# EAGLE design esp32_lolin_clone (EAGLE 9.6.2)
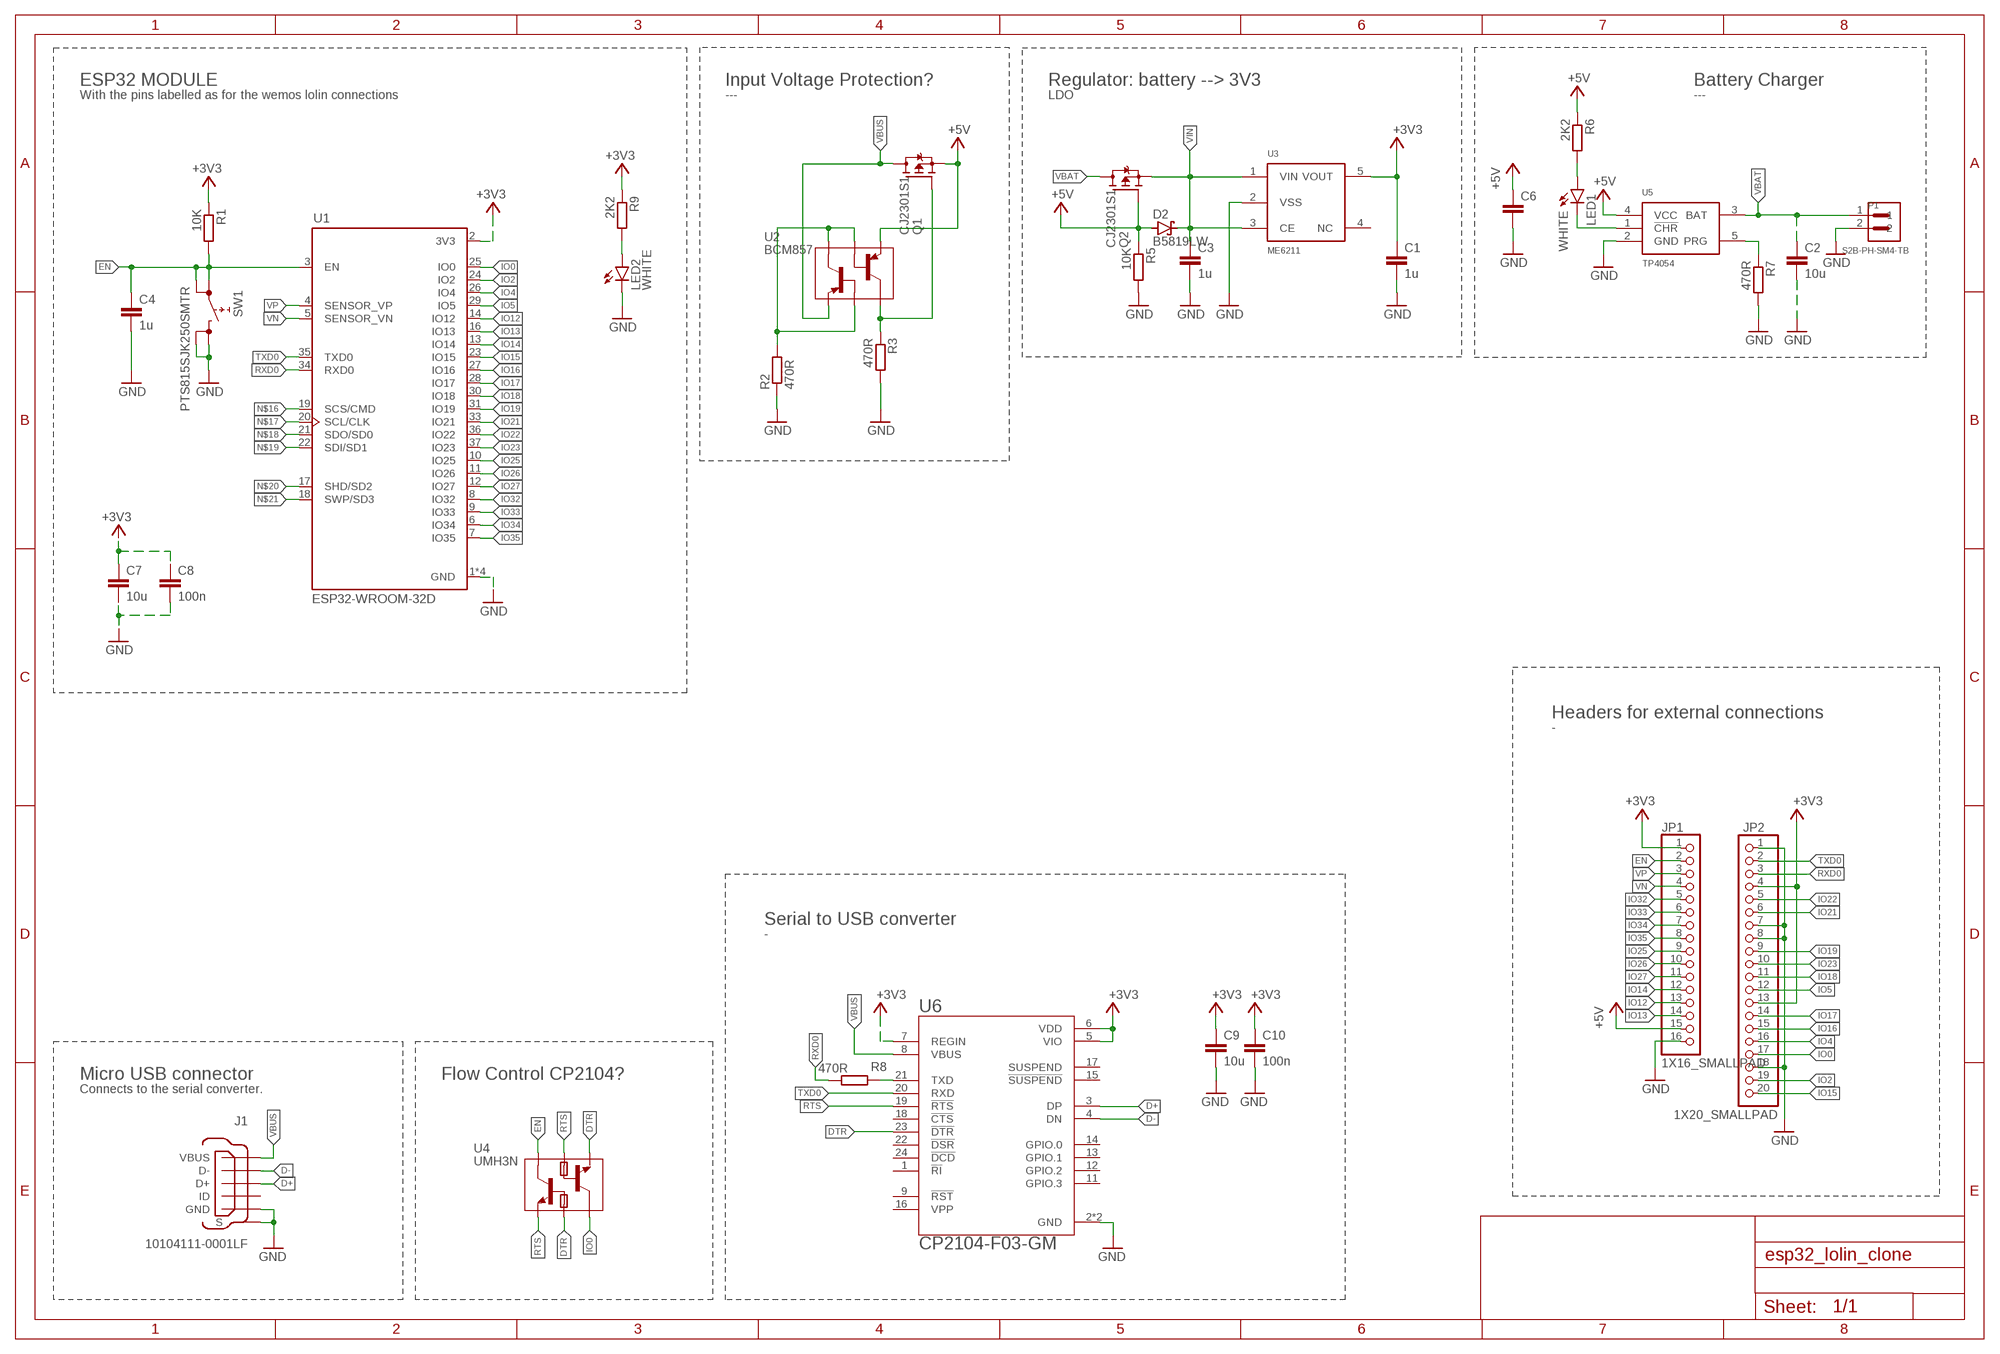
[diagram p0: schematic, sheet 1]

## Parts
C1  1u  C-EUC0603K  [C0603K]
C2  10u  C-EUC0603K  [C0603K]
C3  1u  C-EUC0603K  [C0603K]
C4  1u  C-EUC0603K  [C0603K]
C6  C-EUC0603K  [C0603K]
C7  10u  C-EUC0603K  [C0603K]
C8  100n  C-EUC0603K  [C0603K]
C9  10u  C-EUC0603K  [C0603K]
C10  100n  C-EUC0603K  [C0603K]
D2  B5819LW  [SOD123]
J1  10104111-0001LF  [FRAMATOME_10104111-0001LF]
JP1  1X16_SMALLPAD  [1X16]
JP2  1X20_SMALLPAD  [1X20]
LED1  WHITE  LEDCHIP-LED0603  [CHIP-LED0603]
LED2  WHITE  LEDCHIP-LED0603  [CHIP-LED0603]
P1  S2B-PH-SM4-TB  [JST_S2B-PH-SM4-TB]
Q1  CJ2301S1  [SOT23]
Q2  CJ2301S1  [SOT23]
R1  10K  R-EU_R0603  [R0603]
R2  470R  R-EU_R0603  [R0603]
R3  470R  R-EU_R0603  [R0603]
R5  10K  R-EU_R0603  [R0603]
R6  2K2  R-EU_R0603  [R0603]
R7  470R  R-EU_R0603  [R0603]
R8  470R  R-EU_R0603  [R0603]
R9  2K2  R-EU_R0603  [R0603]
SW1  PTS815SJK250SMTR  [PTS815SJK250SMTR]
U1  ESP32-WROOM-32D  [MODULE_ESP32-WROOM-32D]
U2  BCM857  [SOT363_INFINEON]
U3  ME6211  [SOT23-5]
U4  UMH3N  [SOT363_INFINEON]
U5  TP4054  [SOT23-5]
U6  CP2104-F03-GM  [QFN50P400X400X80-25N]

## Nets
+3V3 [3V3]: C1.1 C7.1 C8.1 C9.1 C10.1 JP1.1 JP2.4 JP2.13 R1.1 R9.1 U1.2(3V3) U3.5(VOUT) U6.5(VIO) U6.6(VDD) U6.7(REGIN)
+5V [5V]: C6.1 D2.2(A) JP1.15 Q1.2(S) Q2.1(G) R5.1 R6.1 U2.4(E2) U5.4(VCC)
D+: J1.3(D+) U6.3(DP)
D-: J1.2(D-) U6.4(DN)
DTR: U4.2(B1) U4.4(E2) U6.23(!DTR)
EN: C4.1 JP1.2 R1.2 SW1.1 SW1.2 U1.3(EN) U4.6(C1)
GND: C1.2 C2.2 C3.2 C4.2 C6.2 C7.2 C8.2 C9.2 C10.2 J1.5(GND) J1.6(S) J1.7(S) J1.8(S) J1.9(S) JP1.16 JP2.1 JP2.7 JP2.8 JP2.18 LED2.C P1.2 R2.1 R3.2 R5.2 R7.2 SW1.3 SW1.4 U1.1(GND) U1.15(GND) U1.38(GND) U1.39(GND) U3.2(VSS) U5.2(GND) U6.2(GND) U6.25(GND)
IO0: JP2.17 U1.25(IO0) U4.3(C2)
IO2: JP2.19 U1.24(IO2)
IO4: JP2.16 U1.26(IO4)
IO5: JP2.12 U1.29(IO5)
IO12: JP1.13 U1.14(IO12)
IO13: JP1.14 U1.16(IO13)
IO14: JP1.12 U1.13(IO14)
IO15: JP2.20 U1.23(IO15)
IO16: JP2.15 U1.27(IO16)
IO17: JP2.14 U1.28(IO17)
IO18: JP2.11 U1.30(IO18)
IO19: JP2.9 U1.31(IO19)
IO21: JP2.6 U1.33(IO21)
IO22: JP2.5 U1.36(IO22)
IO23: JP2.10 U1.37(IO23)
IO25: JP1.9 U1.10(IO25)
IO26: JP1.10 U1.11(IO26)
IO27: JP1.11 U1.12(IO27)
IO32: JP1.5 U1.8(IO32)
IO33: JP1.6 U1.9(IO33)
IO34: JP1.7 U1.6(IO34)
IO35: JP1.8 U1.7(IO35)
N$1: R8.1 U6.21(TXD)
N$2: LED2.A R9.2
N$3: LED1.C U5.1(!CHR)
N$4: LED1.A R6.2
N$7: R2.2 U2.2(B1) U2.5(B2) U2.6(C1)
N$9: Q1.1(G) R3.1 U2.3(C2)
N$14: R7.1 U5.5(PRG)
N$16: U1.19(SCS/CMD)
N$17: U1.20(SCL/CLK)
N$18: U1.21(SDO/SD0)
N$19: U1.22(SDI/SD1)
N$20: U1.17(SHD/SD2)
N$21: U1.18(SWP/SD3)
RTS: U4.1(E1) U4.5(B2) U6.19(!RTS)
RXD0: JP2.3 R8.2 U1.34(RXD0)
TXD0: JP2.2 U1.35(TXD0) U6.20(RXD)
VBAT [VBAT]: C2.1 P1.1 Q2.3(D) U5.3(BAT)
VBUS [5V]: J1.1(VBUS) Q1.3(D) U2.1(E1) U6.8(VBUS)
VIN [5V]: C3.1 D2.1(C) Q2.2(S) U3.1(VIN) U3.3(CE)
VN: JP1.4 U1.5(SENSOR_VN)
VP: JP1.3 U1.4(SENSOR_VP)
Unconnected: J1.4(ID) U3.4(NC) U6.1(!RI) U6.9(!RST!) U6.11(GPIO.3) U6.12(GPIO.2) U6.13(GPIO.1) U6.14(GPIO.0) U6.15(!SUSPEND!) U6.16(VPP) U6.17(SUSPEND) U6.18(!CTS) U6.22(!DSR) U6.24(!DCD)

## Notes on the sheet
- ESP32 MODULE | Input Voltage Protection? | Regulator: battery --> 3V3 | Battery Charger
- With the pins labelled as for the wemos lolin connections | --- | LDO | ---
- Headers for external connections
- -
- Serial to USB converter
- -
- Micro USB connector | Flow Control CP2104?
- Connects to the serial converter.

## Library data of the parts
C1-C4 C6-C10 = rcl:C-EU: CAPACITOR, European symbol; SPICEPREFIX: C
D2 = RE_wemos_lolin_clone:B5819LW: B5819W: SCHOTTKY BARRIER DIODE Peak reverse voltage = 40V RMS Reverse Voltage = 28V Average max current = 0.5A Peak max current = 1.5A Please refer to the Datasheet <https://datasheet.lcsc.com/szlcsc/1810190911_Guangdong-Hottech-B5819LW_C181206.pdf> for more information.; DISTRIBUTOR: LCSC; DISTRIBUTOR_REF: C181206; MANUFACTURER: Guangdong Hottech; MANUFACTURER_REF: B5819LW
J1 = RE_wemos_lolin_clone:10104111-0001LF: 10104111-0001LF:Conn USB Type A/B RCP 5 POS 0.65mm Solder RA SMD 5 Terminal 1 Port T/R. Please refer to the Datasheet <https://www.mouser.de/datasheet/2/18/10104111-1361291.pdf> for more information.; DISTRIBUTOR: Mouser; DISTRIBUTOR_REF: 649-10104111-0001LF; MANUFACTURER: Amphenol ICC; MANUFACTURER_REF: 10104111-0001LF
JP1 = RE_wemos_lolin_clone:1X16_SMALLPAD
JP2 = RE_wemos_lolin_clone:1X20_SMALLPAD
LED1 LED2 = led:LED: LED OSRAM: - CHIPLED LG R971, LG N971, LY N971, LG Q971, LY Q971, LO R971, LY R971 LH N974, LH R974 LS Q976, LO Q976, LY Q976 LO Q996 - Hyper CHIPLED LW Q18S LB Q993, LB Q99A, LB R99A - SideLED LS A670, LO A670, LY A670, LG A670, LP A670 LB A673, LV A673, LT A673, LW A673 LH A674 LY A675 LS A676, LA A676, LO A676, LY A676, LW A676 LS A679, LY A679, LG A679 - Hyper Micro SIDELED® LS Y876, LA Y876, LO Y876, LY Y876 LT Y87S - SmartLED LW L88C, LW L88S LB L89C, LB L89S, LG L890 LS L89K, LO L89K, LY L89K LS L896, LA L896, LO L896, LY L896 - TOPLED LS T670, LO T670, LY T670, LG T670, LP T670 LSG T670, LSP T670, LSY T670, LOP T670, LYG T670 LG T671, LOG T671, LSG T671 LB T673, LV T673, LT T673, LW T673 LH T674 LS T676, LA T676, LO T676, LY T676, LB T676, LH T676, LSB T676, LW T676 LB T67C, LV T67C, LT T67C, LS T67K, LO T67K, LY T67K, LW E67C LS E67B, LA E67B, LO E67B, LY E67B, LB E67C, LV E67C, LT E67C LW T67C LS T679, LY T679, LG T679 LS T770, LO T770, LY T770, LG T770, LP T770 LB T773, LV T773, LT T773, LW T773 LH T774 LS E675, LA E675, LY E675, LS T675 LS T776, LA T776, LO T776, LY T776, LB T776 LHGB T686 LT T68C, LB T68C - Hyper Mini TOPLED® LB M676 - Mini TOPLED Santana® LG M470 LS M47K, LO M47K, LY M47K Source: http://www.osram.convergy.de LUXEON: - LUMILED® LXK2-PW12-R00, LXK2-PW12-S00, LXK2-PW14-U00, LXK2-PW14-V00 LXK2-PM12-R00, LXK2-PM12-S00, LXK2-PM14-U00 LXK2-PE12-Q00, LXK2-PE12-R00, LXK2-PE12-S00, LXK2-PE14-T00, LXK2-PE14-U00 LXK2-PB12-K00, LXK2-PB12-L00, LXK2-PB12-M00, LXK2-PB14-N00, LXK2-PB14-P00, LXK2-PB14-Q00 LXK2-PR12-L00, LXK2-PR12-M00, LXK2-PR14-Q00, LXK2-PR14-R00 LXK2-PD12-Q00, LXK2-PD12-R00, LXK2-PD12-S00 LXK2-PH12-R00, LXK2-PH12-S00 LXK2-PL12-P00, LXK2-PL12-Q00, LXK2-PL12-R00 Source: www.luxeon.com KINGBRIGHT: KA-3528ASYC Source: www.kingbright.com
P1 = RE_wemos_lolin_clone:S2B-PH-SM4-TB: CONN HEADER PH SIDE 2POS 2MM SMD; DISTRIBUTOR: Farnell; DISTRIBUTOR_REF: 9492615; MANUFACTURER: JST Sales; MANUFACTURER_REF: S2B-PH-SM4-TB
Q1 Q2 = RE_wemos_lolin_clone:CJ2301S1: CJ2301S1: P-Channel 20-V(D-S) MOSFET VdsMax = -20V VgsMax = +-8V IDmax = -2.3A IdPulseMax = -10A Please refer to the Datasheet <https://datasheet.lcsc.com/szlcsc/1809141711_Changjiang-Electronics-Tech-CJ-CJ2301-S1_C8547.pdf> for more information.; DISTRIBUTOR: LCSC; DISTRIBUTOR_REF: C8547; MANUFACTURER: Changjiang Electronics Tech; MANUFACTURER_REF: CJ2301 S1
R1-R3 R5-R9 = rcl:R-EU_: RESISTOR, European symbol; SPICEPREFIX: R
SW1 = RE_wemos_lolin_clone:PTS815SJK250SMTR: Datasheet: https://www.mouser.de/datasheet/2/60/pts815-1535658.pdf; DISTRIBUTOR: Mouser; DISTRIBUTOR_REF: 611-PTS815SJK250SMTR; MANUFACTURER: C&K; MANUFACTURER_REF: PTS815SJK250SMTRLFS
U1 = ML_badge:ESP32-WROOM-32D: IC: SoC; GPIO, I2C, I2S, IR, SD, SDIO, SPI, UART; 2.7÷3.6VDC; 20dBm; DISTRIBUTOR: Mouser; DISTRIBUTOR_REF: 356-ESP32WROOM-32D; MANUFACTURER: Espressif Systems; MANUFACTURER_REF: ESP32-WROOM-32D
U2 = RE_wemos_lolin_clone:BCM857: Maximum Output Current: 500mA （VIN＝4.3V,VOUT＝3.3V） Dropout Voltage:100mV@ IOUT=100mA Operating Voltage Range:2V～6.0V Highly Accuracy:±2％ Please refer to the Datasheet <https://assets.nexperia.com/documents/data-sheet/BCM857BV_BS_DS.pdf> for more information.; DISTRIBUTOR: Mouser; DISTRIBUTOR_REF: 771-BCM857BS135; MANUFACTURER: Nexperia; MANUFACTURER_REF: BCM857BS,135
U3 = RE_wemos_lolin_clone:ME6211: ME6211: High Speed LDO Regulators, High PSRR, Low noise, ME6211 Series Maximum Output Current: 500mA （VIN＝4.3V,VOUT＝3.3V） Dropout Voltage:100mV@ IOUT=100mA Operating Voltage Range:2V～6.0V Highly Accuracy:±2％ Please refer to the Datasheet <https://datasheet.lcsc.com/szlcsc/Nanjing-Micro-One-Elec-ME6211C33M5G-N_C82942.pdf> for more information.; DISTRIBUTOR: LCSC; DISTRIBUTOR_REF: C82942; MANUFACTURER: MICRONE; MANUFACTURER_REF: ME6211C33M5G-N
U4 = RE_wemos_lolin_clone:UMH3N: UMH3N: NPN 100mA 50V Complex Digital Transistors (Bias Resistor Built-in Transistors) VCEO = 50V IC(Max.) = 100mA R1 = 4.7kW Built-In Biasing Resistors Please refer to the Datasheet <https://www.mouser.com/datasheet/2/348/umh3ntn-e-1018108.pdf> for more information.; DISTRIBUTOR: Mouser; DISTRIBUTOR_REF: 755-UMH3NFHATN; MANUFACTURER: Rohm; MANUFACTURER_REF: UMH3NFHATN
U5 = RE_wemos_lolin_clone:TP4054: TP4054: Standalone Linear Li-lon Battery Charger with Thermal Regulation in SOT Programmable Charge Current Up to 800mA No MOSFET, Sense Resistor or Blocking Diode Required Preset 4.2V Charge Voltage with 1% Accuracy Charge Status Output Pin Please refer to the CHINESE Datasheet <https://datasheet.lcsc.com/szlcsc/1809261814_TOPPOWER-Nanjing-Extension-Microelectronics-TP4054_C32574.pdf> for more information. Please refer to the TRANSLATED Datasheet <https://www.google.com/url?sa=t&rct=j&q=&esrc=s&source=web&cd=3&cad=rja&uact=8&ved=2ahUKEwi-yqyskMTmAhWHzoUKHW4gB68QFjACegQIAhAC&url=http%3A%2F%2Fimages.100y.com.tw%2Fpdf_file%2F38-TP-TP4054x.pdf&usg=AOvVaw0sjPkwyLlJS0qSuuHZbuhl> for more information.; DISTRIBUTOR: LCSC; DISTRIBUTOR_REF: C32574; MANUFACTURER: TOPPOWER; MANUFACTURER_REF: TP4054
U6 = RE_wemos_lolin_clone:CP2104: Silabs CP2104 USB to UART Bridge USB Bridge, USB to UART USB 2.0 UART Interface 24-QFN _4x4_; DISTRIBUTOR: Mouser; DISTRIBUTOR_REF: None; MANUFACTURER: Silabs; MANUFACTURER_REF: CP2104

## Net classes
0 default: width 0.152 mm, drill 0.3 mm
1 GND: width 0.2 mm, drill 0.3 mm
2 3V3: width 0.5 mm
3 5V: width 0.5 mm
4 VBAT: width 0.6 mm

## Board
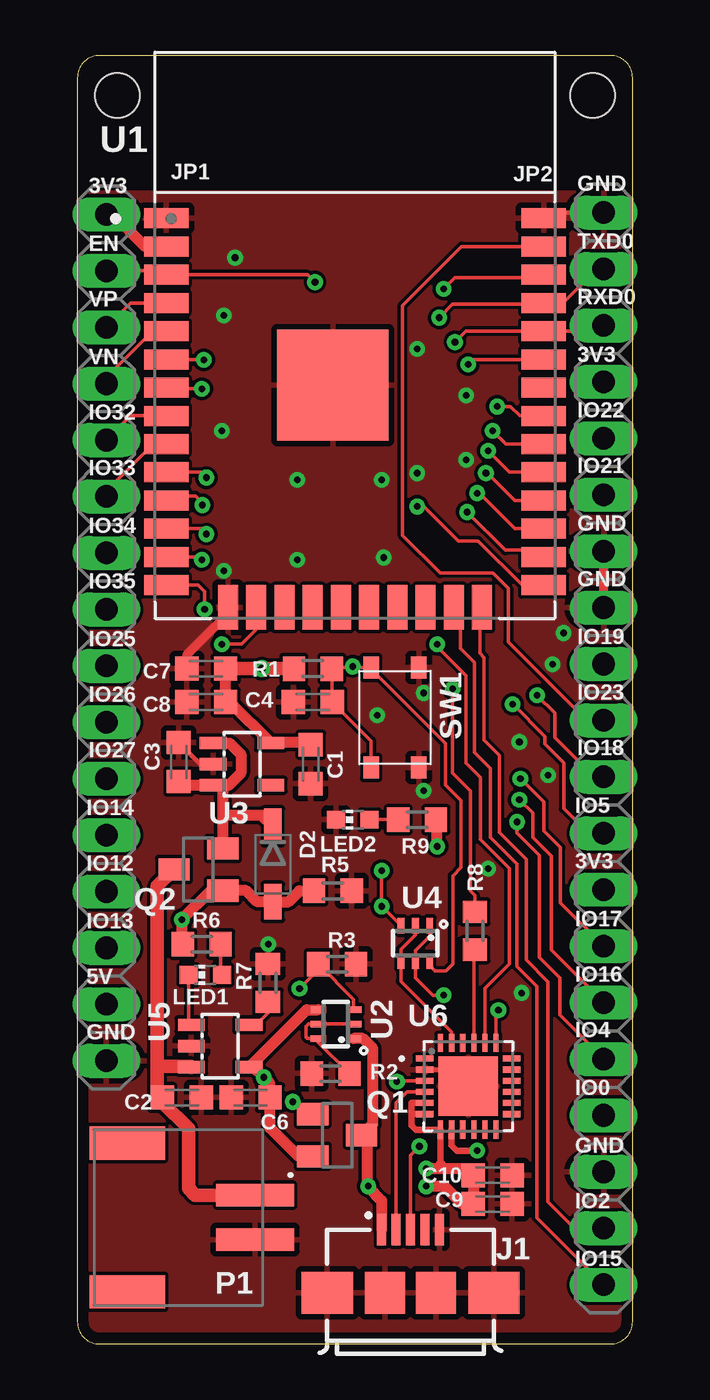
[diagram p1: board, top side]
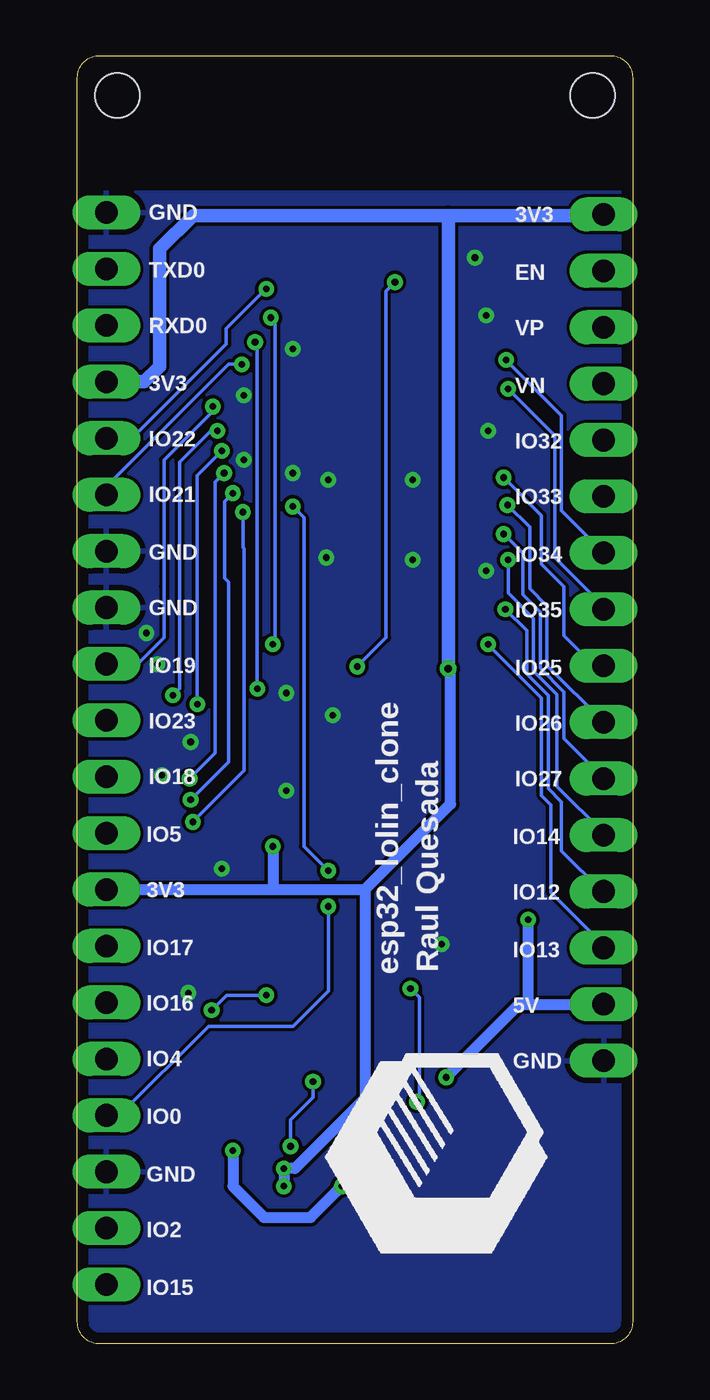
[diagram p2: board, bottom side, seen from below]

Size 25 x 58 mm. Coordinates in mm from the lower left corner, seen from the top.
Outline: 24,58 1,58 arc90 0,57 0,1 arc90 1,0 24,0 arc90 25,1 25,57 arc90 24,58
Copper layers (1*16): Top 0.035mm / dielectric 1.5mm / Bottom 0.035mm
Design rules "ND_PCBWay_2layers_basic": minimum track width 6mil, minimum drill 0.3mm, track to track 6mil, track to pad 6mil, pad to pad 6mil, via to via 6mil, smd to smd 6mil, copper to edge 20mil, drill to drill 6mil, minimum pad ring 10mil, minimum via ring 8mil, stop-mask expansion 4mil, vias tented up to drill 0.5mm, thermal gap 10mil
Holes 2 mm at 1.8,56.2 23.2,56.2
tRestrict: area -1,52 to 26,60
bRestrict: area -2,52 to 27,61

### Footprints (pad centres in the part's own frame; a part is rotated, then mirrored left to right if it is on the bottom)
C0603K = smd 1.05 x 1.08: 1 -0.875,0; 2 0.875,0
SOD123 = smd 1.6 x 0.8: 1 -1.7,0; 2 1.7,0
FRAMATOME_10104111-0001LF = smd 0.4 x 1.4: 1 -1.3,2.85; 2 -0.65,2.85; 3 0,2.85; 4 0.65,2.85; 5 1.3,2.85 | smd 2.3 x 1.9: 6 -3.75,0; 9 3.75,0 | smd 1.8 x 1.9: 7 -1.15,0; 8 1.15,0
1X16 = drill 1.016 pad 1.2 long: 1 -19.05,0; 2 -16.51,0; 3 -13.97,0; 4 -11.43,0; 5 -8.89,0; 6 -6.35,0; 7 -3.81,0; 8 -1.27,0; 9 1.27,0; 10 3.81,0; 11 6.35,0; 12 8.89,0; 13 11.43,0; 14 13.97,0; 15 16.51,0; 16 19.05,0
1X20 = drill 1.016 pad 1.2 long: 1 -24.13,0; 2 -21.59,0; 3 -19.05,0; 4 -16.51,0; 5 -13.97,0; 6 -11.43,0; 7 -8.89,0; 8 -6.35,0; 9 -3.81,0; 10 -1.27,0; 11 1.27,0; 12 3.81,0; 13 6.35,0; 14 8.89,0; 15 11.43,0; 16 13.97,0; 17 16.51,0; 18 19.05,0; 19 21.59,0; 20 24.13,0
CHIP-LED0603 = smd 0.8 x 0.8: A 0,-0.75; C 0,0.75
JST_S2B-PH-SM4-TB = smd 1 x 3.5: 1 1,0; 2 -1,0 | smd 1.5 x 3.4: P1 3.35,5.75; P2 -3.35,5.75
SOT23 = smd 1 x 1.4: 1 -0.95,-1.1; 2 0.95,-1.1; 3 0,1.1
R0603 = smd 1 x 1.1: 1 -0.85,0; 2 0.85,0
PTS815SJK250SMTR = smd 1 x 0.7: 1 -2.25,1.075; 2 2.25,1.075; 3 -2.25,-1.075; 4 2.25,-1.075
MODULE_ESP32-WROOM-32D = smd 2 x 0.9: 1 -8.5,5.26; 2 -8.5,3.99; 3 -8.5,2.72; 4 -8.5,1.45; 5 -8.5,0.18; 6 -8.5,-1.09; 7 -8.5,-2.36; 8 -8.5,-3.63; 9 -8.5,-4.9; 10 -8.5,-6.17; 11 -8.5,-7.44; 12 -8.5,-8.71; 13 -8.5,-9.98; 14 -8.5,-11.25; 25 8.5,-11.25; 26 8.5,-9.98; 27 8.5,-8.71; 28 8.5,-7.44; 29 8.5,-6.17; 30 8.5,-4.9; 31 8.5,-3.63; 32 8.5,-2.36; 33 8.5,-1.09; 34 8.5,0.18; 35 8.5,1.45; 36 8.5,2.72; 37 8.5,3.99; 38 8.5,5.26 | smd 0.9 x 2: 15 -5.715,-12.25; 16 -4.445,-12.25; 17 -3.175,-12.25; 18 -1.905,-12.25; 19 -0.635,-12.25; 20 0.635,-12.25; 21 1.905,-12.25; 22 3.175,-12.25; 23 4.445,-12.25; 24 5.715,-12.25 | smd 5 x 5: 39 -1,-2.24
SOT363_INFINEON = smd 0.3 x 0.7: 1 -0.65,-0.8; 2 0,-0.8; 3 0.65,-0.8; 4 0.65,0.8; 5 0,0.8; 6 -0.65,0.8
SOT23-5 = smd 0.55 x 1.2: 1 -0.95,-1.3; 2 0,-1.3; 3 0.95,-1.3; 4 0.95,1.3; 5 -0.95,1.3
QFN50P400X400X80-25N = smd 0.81 x 0.26: 1 -1.955,1.25; 2 -1.955,0.75; 3 -1.955,0.25; 4 -1.955,-0.25; 5 -1.955,-0.75; 6 -1.955,-1.25; 13 1.955,-1.25; 14 1.955,-0.75; 15 1.955,-0.25; 16 1.955,0.25; 17 1.955,0.75; 18 1.955,1.25 | smd 0.26 x 0.81: 7 -1.25,-1.955; 8 -0.75,-1.955; 9 -0.25,-1.955; 10 0.25,-1.955; 11 0.75,-1.955; 12 1.25,-1.955; 19 1.25,1.955; 20 0.75,1.955; 21 0.25,1.955; 22 -0.25,1.955; 23 -0.75,1.955; 24 -1.25,1.955 | smd 2.68 x 2.68: 25 0,0

### Placement (x,y rotation side)
C1  10.5,26.1 270 top
C2  4.7,11.1 0 top
C3  4.56,26.2 90 top
C4  10.6,28.9 180 top
C6  7.8,11.1 180 top
C7  5.8,30.4 180 top
C8  5.8,28.9 180 top
C9  18.7,6.3 0 top
C10  18.7,7.6 0 top
D2  8.8,21.6 270 top
J1  15,2.3 0 top
JP1  1.3,31.8 270 top
JP2  23.7,26.8 270 top
LED1  5.76,16.62 90 top
LED2  12.4,23.6 90 top
P1  8,5.7 90 top
Q1  11.7,9.4 270 top
Q2  5.45,21.36 90 top
R1  10.6,30.4 0 top
R2  11.4,12.17 0 top
R3  11.7,17.1 0 top
R5  11.5,20.4 0 top
R6  5.6,18 0 top
R7  8.58,16.25 90 top
R8  17.9,18.6 90 top
R9  15.3,23.6 180 top
SW1  14.3,28.2 90 top
U1  12.5,45.41 0 top
U2  11.64,14.4 90 top
U3  7.41,26.1 270 top
U4  15.22,18.04 180 top
U5  6.43,13.41 270 top
U6  17.6,11.6 0 top
U$1  [RE_LOGO_10MM]  7.69,9.16 90 bottom

### Tracks (layer width: path | path; a pad name or v marks a point on that pad's centre or on a via)
+3V3  (via drill 0.3, 0.35)
  Top 0.3: U6.5 15.05,10.85 15.05,10.35 | 15.05,10.35 U6.6 | 15.05,10.35 15.05,9.85 15.26,9.64 U6.7 16.35,8.05
  Top 0.5: U1.2 3.05,49.4 1.6,50.85 JP1.1 | C7.1 C8.1 6.86,28.9 U3.5 8.73,27.07 10.4,27.07 C1.1 | v15.7,7.1 16.52,7.1 17.32,6.3 C9.1 C10.1 17.76,7.54 17.4,7.9 16.5,7.9 | v16.2,22.4 16.2,23.55 R9.1 | v15.7,7.9 16.5,7.9 | 16.35,8.05 16.5,7.9
  Top 0.6: R1.1 v8.3,30.4 C7.1
  Bottom 0.5: JP2.13 16.2,20.45 | 16.2,20.45 12.05,20.45 | 12.05,20.45 8.2,24.3 8.2,30.3 v8.3,30.4 | 12.05,20.45 12.05,11.05 15.2,7.9 v15.7,7.9 v15.7,7.1 | v16.2,22.4 16.2,20.45
  Bottom 0.6: JP2.4 21.99,43.31 21.3,44 21.3,49.3 19.8,50.8 8.3,50.8 | 8.3,50.8 1.65,50.8 1.6,50.85 JP1.1 | v8.3,30.4 8.3,50.8
+5V  (via drill 0.3)
  Top 0.5: Q1.2 9.95,8.45 8.68,9.72 C6.1 8.68,11.72 v8.4,12 7.94,12.46 U5.4 10.32,15.05 U2.4 | R6.1 4.7,18.05 v4.7,19.1 6.01,20.41 Q2.1 7.59,20.41 8.1,19.9 D2.2 9.5,19.9 10,20.4 R5.1
  Bottom 0.5: v8.4,12 5.11,15.29 4.8,15.29 | 4.8,15.29 JP1.15 | 4.8,15.29 4.7,15.39 v4.7,19.1
D+  (via drill 0.3)
  Top 0.152: J1.3 15,8.5 v15.4,8.9 | v14.39,11.81 14.41,11.81 14.45,11.85 U6.3
  Bottom 0.152: v15.4,8.9 15.4,10.1 14.4,11.1 v14.4,11.8
  Bottom 0.3: v14.4,11.8 v14.39,11.81
D-
  Top 0.152: J1.2 14.35,8.91 14.35,10.85 14.85,11.35 U6.4
DTR
  Top 0.152: U6.23 16.85,14.05 14.57,16.33 U4.4 14.57,17.77 15.22,18.42 U4.2
EN  (via drill 0.3)
  Top 0.152: 12.4,30.45 11.5,30.45 R1.2 11.47,30.38 C4.1 13.22,27.15 SW1.1 | 12.4,30.45 SW1.2 13.22,30.38 16.57,27.04 16.57,25.17 17.28,24.46 17.28,21.46 16.9,21.08 16.9,17.1 16.6,16.8 16.1,16.8 15.87,17.03 U4.6 | v12.4,30.5 12.4,30.45 | v10.7,47.8 10.37,48.13 U1.3 3.8,48.13 3.62,48.31 JP1.2
  Bottom 0.152: v12.4,30.5 11.1,31.8 11.1,47.4 v10.7,47.8
GND  (via drill 0.3)
  Top 0.152: U3.2 5.54,26.1 | U1.38 21.26,50.93
  Top 0.2: 5.54,26.1 C3.2 | 21.26,50.93 JP2.1 | U6.2 17.45,12.35 17.6,12.2 U6.25
  Top 0.4: U1.15 6.79,32.88 4.92,31.02 C7.2 | JP2.8 JP2.7
  other vias: 13.8,35.4 13.7,38.9 9.9,38.9 9.9,35.3 21.9,32 21.4,30.6 19.9,27.1 21.2,25.6 20,15.8 7.1,48.9 6.6,46.3 6.5,41.1 6.6,34.8 18.5,21.4 15.3,39.2 15.3,44.8 17.5,42.7 17.5,39.8 8.6,18 15.6,24.9 15.6,29.3 13.5,28.3
  pour Top: -1,59 26,59 26,-1 -1,-1
  pour Bottom: -2,60 27,60 27,-2 -2,-2
IO0  (via drill 0.3)
  Top 0.152: U1.25 20.04,34.16 18.05,36.15 17.15,36.15 15.6,37.7 v15.3,37.7 | v13.7,21.3 v13.7,19.69 13.72,19.69 U4.3
  Bottom 0.152: v15.3,37.7 14.8,37.2 14.8,22.4 v13.7,21.3 | v13.7,19.69 13.7,15.9 15.3,14.3 19.1,14.3 23.11,10.29 JP2.17
IO2
  Top 0.152: U1.24 18.11,33.06 18.11,31.1 18.31,30.91 18.31,27.19 19,26.5 19,23.03 20.22,21.82 20.22,17.28 21.19,16.31 21.19,6.4 22.38,5.21 JP2.19
IO4  (via drill 0.3)
  Top 0.152: JP2.16 21.71,14.81 21.71,16.48 20.8,17.4 20.8,22 19.8,23 v19.8,23.5 v19.81,23.5 | U1.26 20.7,35.73 19.27,35.73 v17.55,37.45
  Bottom 0.152: v19.81,23.5 17.5,25.81 17.5,35.8 17.55,35.85 v17.55,37.45
IO5  (via drill 0.3)
  Top 0.152: v19.6,28.8 21.05,27.35 21.05,27 21.9,26.15 21.9,24.1 23.01,22.99 JP2.12 | U1.29 19.46,39.24 v18.5,40.2
  Bottom 0.152: v19.6,28.8 19.6,39.1 v18.5,40.2 | v18.5,40.2
IO12  (via drill 0.3)
  Top 0.152: U1.14 5.44,34.16 5.73,33.87 v5.73,33.07
  Bottom 0.152: v5.73,33.07 4.77,32.11 4.77,30.17 3.8,29.2 3.8,25 3.2,24.4 3.2,22.2 1.37,20.37 JP1.13
IO13  (via drill 0.3)
  Top 0.152: U1.16 8.05,32.16 7.4,31.5 v6.5,31.5
  Bottom 0.152: v6.5,31.5 6.5,31.47 4.11,29.07 4.11,24.7 3.67,24.27 3.67,20.33 1.3,17.95 JP1.14
IO14  (via drill 0.3)
  Top 0.152: U1.13 5.47,35.43 v5.6,35.3
  Bottom 0.152: v5.6,35.3 5.6,33.8 4.46,32.66 4.46,30.29 3.4,29.23 3.4,25.11 1.3,23 JP1.12
IO15
  Top 0.152: U1.23 17.25,32.86 17.25,31.3 17.87,30.67 17.87,26.63 18.6,25.9 18.6,22.8 19.8,21.6 19.8,16.99 20.69,16.1 20.69,5.68 JP2.20
IO16  (via drill 0.3)
  Top 0.152: JP2.15 21.34,17.73 21.34,21.96 20.5,22.8 20.5,23.9 v19.9,24.5 | v18,38.3 18.1,38.3 19.7,36.7 U1.27
  Bottom 0.152: v19.9,24.5 18.2,26.2 18.2,34.3 18.37,34.47 18.37,37.93 v18,38.3
IO17  (via drill 0.3)
  Top 0.152: JP2.14 21.75,19.86 21.75,22.34 21,23.1 21,24.41 v19.95,25.45 | U1.28 19.7,37.97 18.47,39.2 v18.39,39.2
  Bottom 0.152: v19.95,25.45 18.8,26.6 18.8,38.79 v18.39,39.2
IO18  (via drill 0.3)
  Top 0.152: U1.30 19.29,40.51 v18.7,41.1 | v20.7,29.2 21.5,28.4 21.5,27.3 23.27,25.53 JP2.11
  Bottom 0.152: v18.7,41.1 19,41.1 20.4,39.7 20.4,29.5 v20.7,29.2
IO19  (via drill 0.3)
  Top 0.152: U1.31 19.92,41.78 19.5,42.2 v18.9,42.2
  Bottom 0.152: v18.9,42.2 18.9,42 21.1,39.8 21.1,34.1 21.1,31.8 22.29,30.61 JP2.9
IO21  (via drill 0.3)
  Top 0.152: U1.33 17.82,44.32 v17.6,44.1
  Bottom 0.152: v17.6,44.1 18.2,44.1 23.7,38.6 JP2.6
IO22  (via drill 0.3)
  Top 0.152: U1.36 20.87,48 17,48 v16.5,47.5
  Bottom 0.152: v16.5,47.5 18.3,45.7 18.3,45 22.53,40.77 JP2.5
IO23
  Top 0.152: U1.37 17.3,49.4 14.64,46.74 14.64,36.4 16.34,34.7 18.7,34.7 19.4,34 19.4,31.61 22.93,28.07 JP2.10
IO25  (via drill 0.3)
  Top 0.152: U1.10 5.56,39.24 v5.8,39
  Bottom 0.152: v5.8,39 4.1,37.3 4.1,35.1 3.1,34.1 3.1,31.9 1.73,30.53 JP1.9
IO26  (via drill 0.3)
  Top 0.152: U1.11 4.2,38.17 5.33,38.17 5.63,37.87 v5.63,37.77
  Bottom 0.152: v5.63,37.77 4.63,36.77 4.63,34 3.85,33.22 3.85,30.55 JP1.10
IO27  (via drill 0.3)
  Top 0.152: U1.12 5.6,36.7 5.8,36.5 v5.8,36.46
  Bottom 0.152: v5.8,36.46 4.94,35.6 4.94,33.74 4.16,32.96 4.16,30.42 3.1,29.36 3.1,27.25 JP1.11
IO32
  Top 0.152: U1.8 2.39,41.78 JP1.5
IO33
  Top 0.152: U1.9 3.41,40.51 1.3,38.4 JP1.6
IO34  (via drill 0.3)
  Top 0.152: U1.6 5.68,44.32 v5.7,44.3
  Bottom 0.152: v5.7,44.3 3.2,41.8 3.2,37.51 JP1.7
IO35  (via drill 0.3)
  Top 0.152: U1.7 4.05,43 v5.61,43
  Bottom 0.152: v5.61,43 3.5,40.9 3.5,35.4 1.3,33.19 JP1.8
N$1
  Top 0.152: U6.21 17.85,17.7 R8.1
N$2
  Top 0.152: R9.2 LED2.A
N$3
  Top 0.152: LED1.C 5.01,14.48 U5.1
N$4
  Top 0.152: LED1.A 6.45,16.68 R6.2
N$7
  Top 0.152: R2.2 10.84,13.58 U2.6 10.35,13.75 10.3,13.8 10.3,14.3 10.4,14.4 U2.5 U2.2
N$9  (via drill 0.3)
  Top 0.152: Q1.1 10.25,10.35 v9.7,10.9 v9.71,10.9 | v10,16 10.85,16.85 R3.1 12.44,15.51 U2.3
  Bottom 0.152: v9.71,10.9 9.6,11.01 9.6,15.6 v10,16
N$14
  Top 0.152: U5.5 8.03,14.36 8.58,14.91 R7.1
RTS  (via drill 0.3)
  Top 0.152: v16.5,15.7 16,15.7 15.22,16.48 U4.5 15.22,17.72 15.87,18.37 U4.1 | v18.96,15.02 18.85,14.92 U6.19
  Bottom 0.152: v16.5,15.7 18.28,15.7 v18.96,15.02
RXD0  (via drill 0.3)
  Top 0.152: JP2.3 23.44,45.59 U1.34 17.49,45.59 v17,45.1 | R8.2 17.9,20.2 17.7,20.4 17.7,24.9 16.89,25.71 v16.89,29.49
  Bottom 0.152: v17,45.1 16.9,45 v16.9,29.5 v16.89,29.49
TXD0  (via drill 0.3)
  Top 0.152: JP2.2 23.39,48.39 21.86,46.86 U1.35 20.94,46.8 16.89,46.8 v16.29,46.2 | v16.2,31.5 16.2,31.4 17.5,30.1 17.5,26.15 18.15,25.5 18.15,22.7 19.45,21.4 19.45,17.1 18.35,16 U6.20
  Bottom 0.152: v16.29,46.2 16.1,46.01 16.1,31.6 v16.2,31.5
VBAT
  Top 0.6: Q2.3 3.6,20.61 3.6,12.5 | 3.6,12.5 3.6,11.32 C2.1 3.83,10.88 5,9.7 5,7 5.3,6.7 P1.1 | U5.3 5.09,12.5 3.6,12.5
VBUS  (via drill 0.3)
  Top 0.3: U6.8 16.85,8.95 17.1,8.7 v18,8.7
  Top 0.5: J1.1 13.7,6.45 13.1,7.05 v13.1,7.1 13.05,7.15 13.05,9.15 Q1.3 13.3,9.9 13.3,13.3 12.85,13.75 U2.1
  Bottom 0.5: v18,8.7 18,7.1 16.6,5.7 14.5,5.7 v13.1,7.1
VIN
  Top 0.5: U3.3 4.74,25.15 C3.1 | Q2.2 6.55,23.8 | 6.55,23.8 6.55,24.95 6.35,25.15 U3.3 | U3.1 6.85,27.05 7.36,26.54 7.36,25.7 6.81,25.15 U3.3 | D2.1 8.3,23.8 6.55,23.8
VN
  Top 0.152: U1.5 3.39,45.59 1.3,43.5 JP1.4
VP
  Top 0.152: U1.4 2.39,46.86 JP1.3

### Text on the board
tPlace: 3V3 | GND | EN | TXD0 | VP | RXD0 | VN | 3V3 | IO32 | IO22 | IO33 | IO21 | GND | IO34 | IO35 | GND | IO19 | IO25 | IO26 | IO23 | IO27 | IO18 | IO14 | IO5 | IO12 | 3V3 | IO13 | IO17 | 5V | IO16 | GND | IO4 | IO0 | GND | IO2 | IO15
bPlace: GND | 3V3 | EN | TXD0 | RXD0 | VP | VN | 3V3 | IO32 | IO22 | IO33 | IO21 | IO34 | GND | IO35 | GND | IO25 | IO19 | IO26 | IO23 | IO27 | IO18 | IO5 | IO14 | IO12 | 3V3 | IO17 | IO13 | 5V | IO16 | GND | IO4 | IO0 | GND | IO2 | IO15
bNames: Raul Quesada